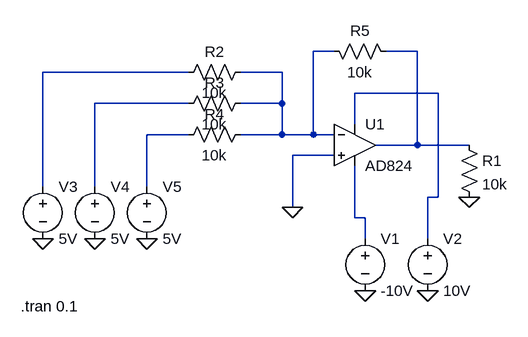
[diagram p0: schematic Draft3.asc]
Draft3.asc, the LTspice schematic file:
Version 4
SHEET 1 880 680
WIRE 176 0 144 0
WIRE 304 0 256 0
WIRE -48 32 -272 32
WIRE 96 32 32 32
WIRE 336 64 208 64
WIRE -48 80 -192 80
WIRE 96 80 96 32
WIRE 96 80 32 80
WIRE 208 112 208 64
WIRE -48 128 -112 128
WIRE 96 128 96 80
WIRE 96 128 32 128
WIRE 144 128 144 0
WIRE 144 128 96 128
WIRE 176 128 144 128
WIRE 304 144 304 0
WIRE 304 144 240 144
WIRE 384 144 304 144
WIRE 176 160 112 160
WIRE -272 208 -272 32
WIRE -192 208 -192 80
WIRE -112 208 -112 128
WIRE 336 224 336 64
WIRE 336 224 320 224
WIRE 112 240 112 160
WIRE 208 256 208 176
WIRE 224 256 208 256
WIRE 224 288 224 256
WIRE 320 288 320 224
FLAG 384 224 0
FLAG 224 368 0
FLAG 320 368 0
FLAG -112 288 0
FLAG -192 288 0
FLAG -272 288 0
FLAG 112 240 0
SYMBOL OpAmps\\AD824 208 80 R0
SYMATTR InstName U1
SYMBOL res 368 128 R0
SYMATTR InstName R1
SYMATTR Value 10k
SYMBOL res 48 16 R90
WINDOW 0 0 56 VBottom 2
WINDOW 3 32 56 VTop 2
SYMATTR InstName R2
SYMATTR Value 10k
SYMBOL res 48 64 R90
WINDOW 0 0 56 VBottom 2
WINDOW 3 32 56 VTop 2
SYMATTR InstName R3
SYMATTR Value 10k
SYMBOL res 48 112 R90
WINDOW 0 0 56 VBottom 2
WINDOW 3 32 56 VTop 2
SYMATTR InstName R4
SYMATTR Value 10k
SYMBOL voltage 224 272 R0
WINDOW 123 0 0 Left 0
WINDOW 39 0 0 Left 0
SYMATTR InstName V1
SYMATTR Value -10V
SYMBOL voltage 320 272 R0
WINDOW 123 0 0 Left 0
WINDOW 39 0 0 Left 0
SYMATTR InstName V2
SYMATTR Value 10V
SYMBOL voltage -272 192 R0
WINDOW 123 0 0 Left 0
WINDOW 39 0 0 Left 0
SYMATTR InstName V3
SYMATTR Value 5V
SYMBOL voltage -192 192 R0
WINDOW 123 0 0 Left 0
WINDOW 39 0 0 Left 0
SYMATTR InstName V4
SYMATTR Value 5V
SYMBOL voltage -112 192 R0
WINDOW 123 0 0 Left 0
WINDOW 39 0 0 Left 0
SYMATTR InstName V5
SYMATTR Value 5V
SYMBOL res 160 -16 M90
WINDOW 0 0 56 VBottom 2
WINDOW 3 32 56 VTop 2
SYMATTR InstName R5
SYMATTR Value 10k
TEXT -306 392 Left 2 !.tran 0.1

The netlist it stands for:
* Draft3.asc
XU1 0 N001 N004 N007 N002 AD824  ; pins In+ In- V+ V- OUT
R1 N002 0 10k
R2 N001 N003 10k
R3 N001 N005 10k
R4 N001 N006 10k
V1 N007 0 -10V
V2 N004 0 10V
V3 N003 0 5V
V4 N005 0 5V
V5 N006 0 5V
R5 N001 N002 10k
.tran 0.1
.backanno
.end